# Altium schematic sheet 2.Support.SchDoc
size A3; SheetNumber: 3; SheetTotal: 10
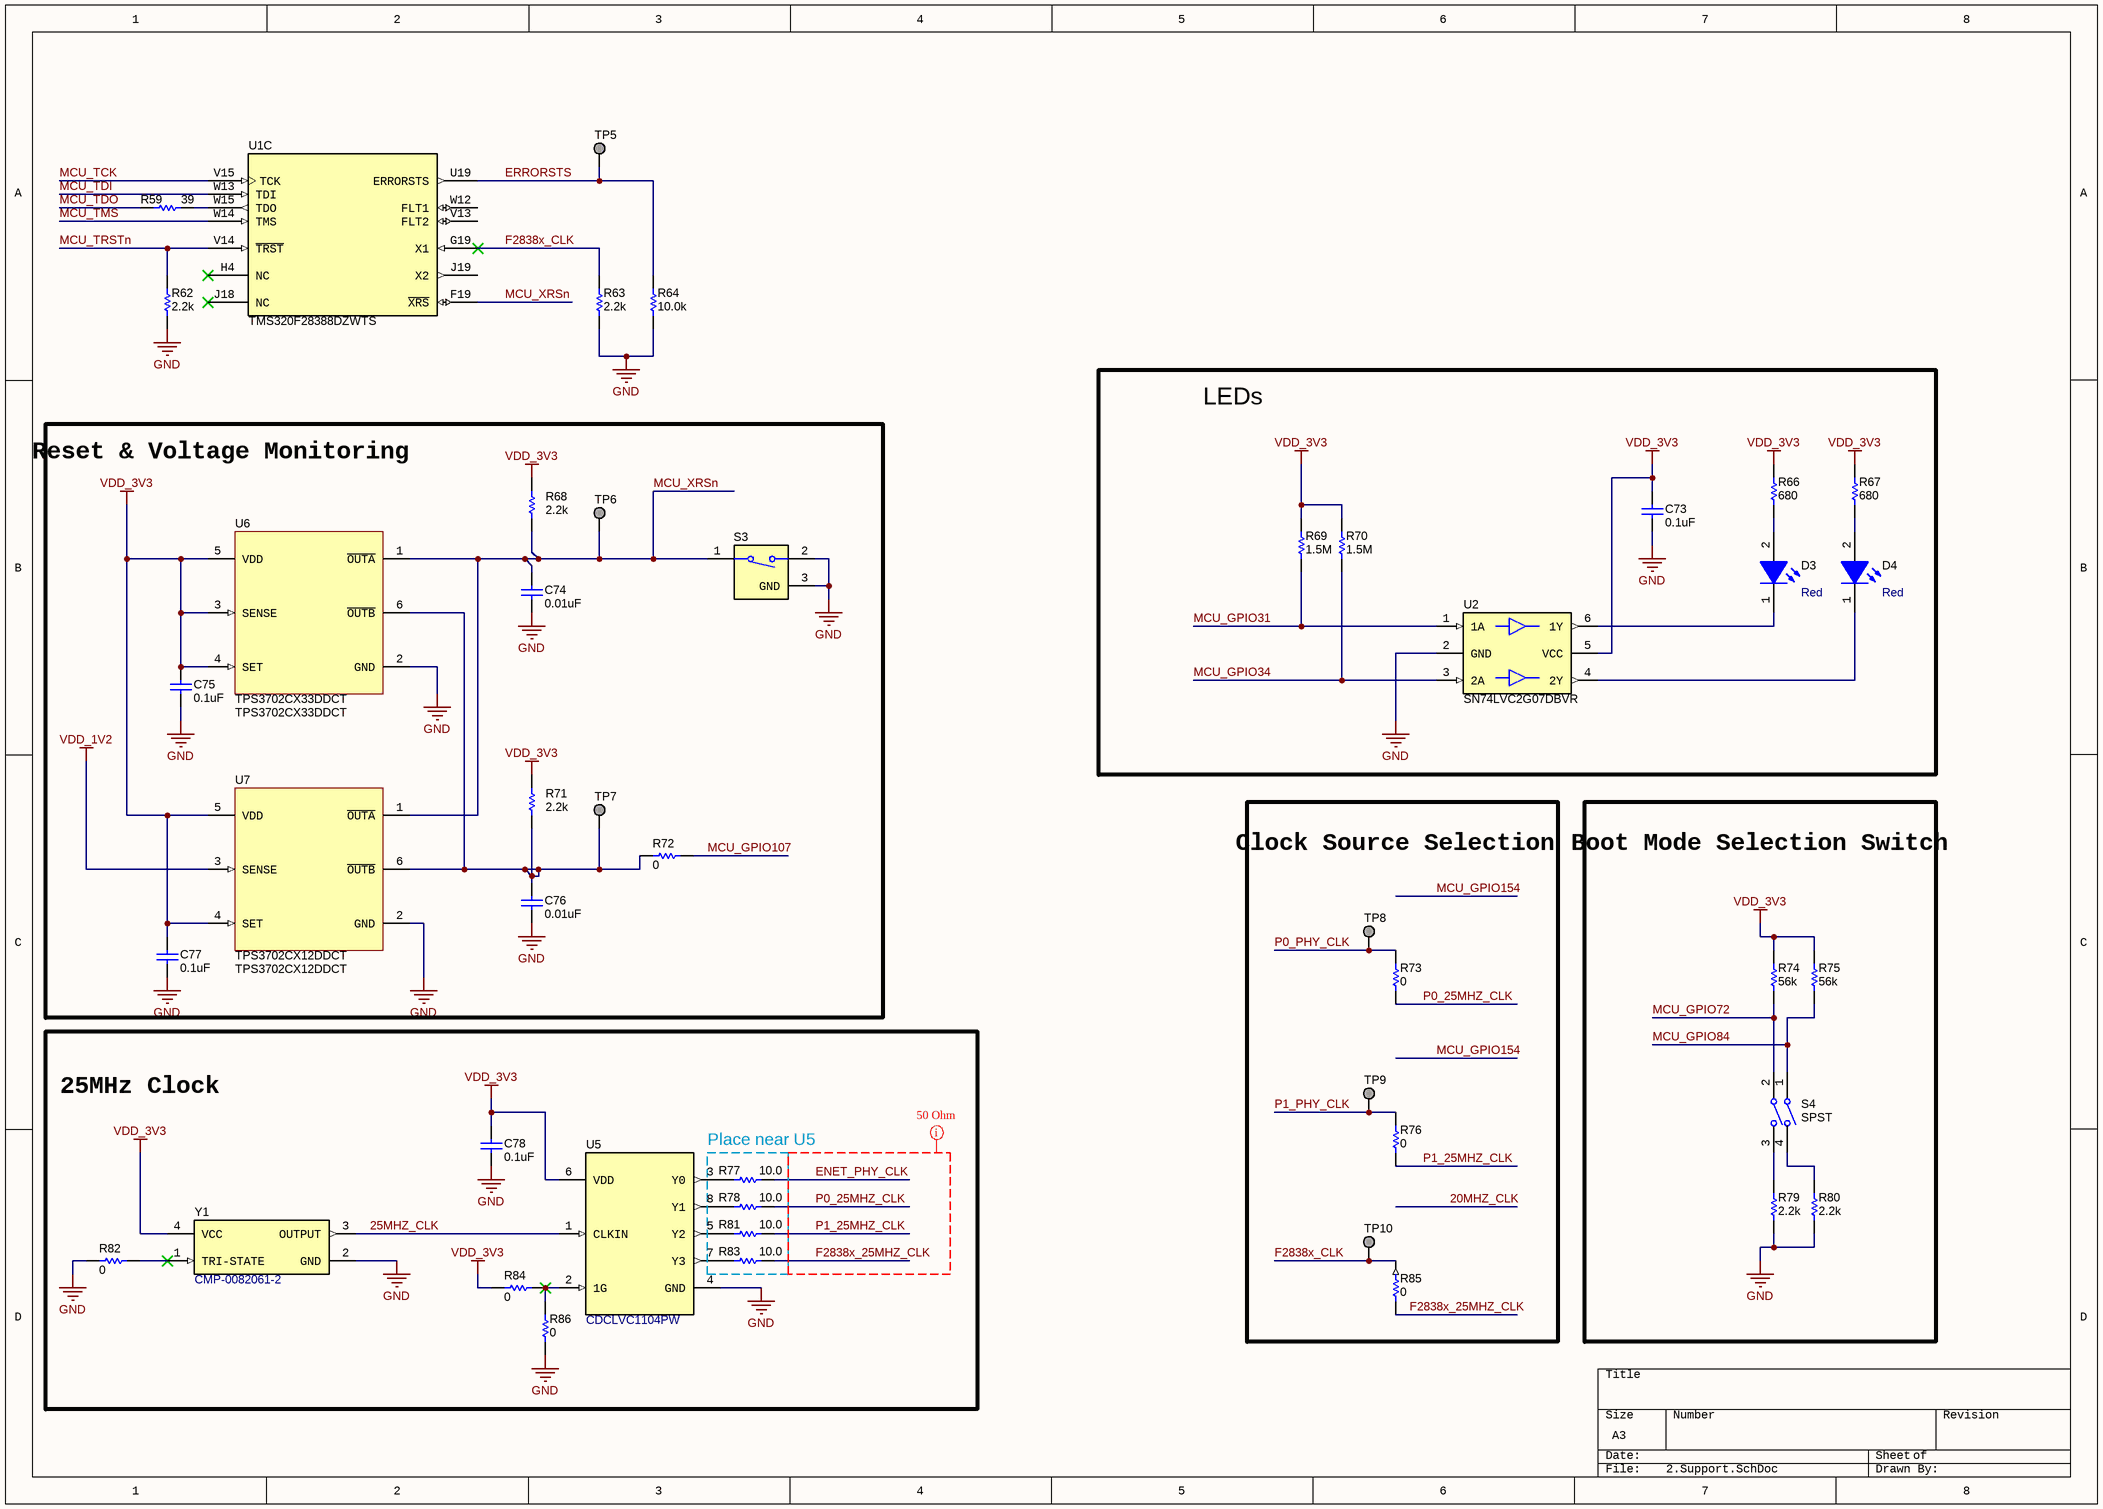
[diagram p0: 2.Support.SchDoc]

## Parts
C73  ValueDisplayed: 0.1uF  [0402]  (hidden comment: CL05B104KP5NNNC)
C74  ValueDisplayed: 0.01uF  [0402]  (hidden comment: C0402C103J5RACTU)
C75  ValueDisplayed: 0.1uF  [0402]  (hidden comment: CL05B104KP5NNNC)
C76  ValueDisplayed: 0.01uF  [0402]  (hidden comment: C0402C103J5RACTU)
C77  ValueDisplayed: 0.1uF  [0402]  (hidden comment: CL05B104KP5NNNC)
C78  ValueDisplayed: 0.1uF  [0402]  (hidden comment: CL05B104KP5NNNC)
D3  value Red  [WL-SMCW_RED_0805]  (hidden comment: 150080SS75000)
D4  value Red  [WL-SMCW_RED_0805]  (hidden comment: 150080SS75000)
R59  ValueDisplayed: 39  [0402]  (hidden comment: CRCW040239R0JNED)
R62  ValueDisplayed: 2.2k  [0402]  (hidden comment: CRCW04022K20JNED)
R63  ValueDisplayed: 2.2k  [0402]  (hidden comment: CRCW04022K20JNED)
R64  ValueDisplayed: 10.0k  [0402]  (hidden comment: RC0402FR-0710KL)
R66  ValueDisplayed: 680  [0402]  (hidden comment: CRCW0402680RJNED)
R67  ValueDisplayed: 680  [0402]  (hidden comment: CRCW0402680RJNED)
R68  ValueDisplayed: 2.2k  [0402]  (hidden comment: CRCW04022K20JNED)
R69  ValueDisplayed: 1.5M  [0402]  (hidden comment: CRCW04021M50JNED)
R70  ValueDisplayed: 1.5M  [0402]  (hidden comment: CRCW04021M50JNED)
R71  ValueDisplayed: 2.2k  [0402]  (hidden comment: CRCW04022K20JNED)
R72  ValueDisplayed: 0  [0603]  (hidden comment: CRCW06030000Z0EA)
R73  ValueDisplayed: 0  [0603]  (hidden comment: CRCW06030000Z0EA)
R74  ValueDisplayed: 56k  [0402]  (hidden comment: CRCW040256K0JNED)
R75  ValueDisplayed: 56k  [0402]  (hidden comment: CRCW040256K0JNED)
R76  ValueDisplayed: 0  [0603]  (hidden comment: CRCW06030000Z0EA)
R77  ValueDisplayed: 10.0  [CPF0402]  (hidden comment: CPF0402B10RE1)
R78  ValueDisplayed: 10.0  [CPF0402]  (hidden comment: CPF0402B10RE1)
R79  ValueDisplayed: 2.2k  [0402]  (hidden comment: CRCW04022K20JNED)
R80  ValueDisplayed: 2.2k  [0402]  (hidden comment: CRCW04022K20JNED)
R81  ValueDisplayed: 10.0  [CPF0402]  (hidden comment: CPF0402B10RE1)
R82  ValueDisplayed: 0  [0402]  (hidden comment: CRCW04020000Z0EDHP)
R83  ValueDisplayed: 10.0  [CPF0402]  (hidden comment: CPF0402B10RE1)
R84  ValueDisplayed: 0  [0402]  (hidden comment: CRCW04020000Z0EDHP)
R85  ValueDisplayed: 0  [0603]  (hidden comment: CRCW06030000Z0EA)
R86  ValueDisplayed: 0  [0402]  (hidden comment: CRCW04020000Z0EDHP)
S3  B3U-1100P  [SW_B3U-1100P]  (value not drawn)
S4  Circuit: SPST  [SW_218-2LP]  (hidden comment: 218-2LPST)
TP5  TESTPOINT  [TP_50MIL-25MILHOLE]  (value not drawn)  (no BOM)
TP6  TESTPOINT  [TP_50MIL-25MILHOLE]  (value not drawn)  (no BOM)
TP7  TESTPOINT  [TP_50MIL-25MILHOLE]  (value not drawn)  (no BOM)
TP8  TESTPOINT  [TP_50MIL-25MILHOLE]  (value not drawn)  (no BOM)
TP9  TESTPOINT  [TP_50MIL-25MILHOLE]  (value not drawn)  (no BOM)
TP10  TESTPOINT  [TP_50MIL-25MILHOLE]  (value not drawn)  (no BOM)
U1  TMS320F28388DZWTS  [ZWT0337A-IPC_B]  (part C of 5)
U2  SN74LVC2G07DBVR  [DBV0006A_N]
U5  CDCLVC1104PW  [PW0008A_N]
U6  TPS3702CX33DDCT  [DDC0006A_N]
U7  TPS3702CX12DDCT  [DDC0006A_N]
Y1  CMP-0082061-2  [ECS_ECS-2520S]

## Blocks framed on the sheet
LEDs: C73 D3 D4 R66 R67 R69 R70 U2
Reset & Voltage Monitoring: C74-C77 R68 R71 R72 S3 TP6 TP7 U6 U7
Clock Source Selection: R73 R76 R85 TP8-TP10
Boot Mode Selection Switch: R74 R75 R79 R80 S4
25MHz Clock: C78 R77 R78 R81-R84 R86 U5 Y1

## Nets
GND: C73.2 C74.2 C75.2 C76.2 C77.2 C78.2 R62.1 R63.1 R64.1 R79.2 R80.1 R82.2 R86.2 S3.2 S3.3(GND) U2.2(GND) U5.4(GND) U6.2(GND) U7.2(GND) Y1.2(GND)
VDD_1V2: U7.3(SENSE)
VDD_3V3: C73.1 C75.1 C77.1 C78.1 R66.1 R67.1 R68.2 R69.2 R70.2 R71.2 R74.1 R75.2 R84.1 U2.5(VCC) U5.6(VDD) U6.3(SENSE) U6.4(SET) U6.5(VDD) U7.4(SET) U7.5(VDD) Y1.4(VCC)
25MHZ_CLK: U5.1(CLKIN) Y1.3(OUTPUT)
ENET_PHY_CLK: R77.2
ERRORSTS: R64.2 TP5.1 U1.U19(ERRORSTS)
F2838x_25MHZ_CLK: R83.2 R85.2
F2838x_CLK: R63.2 R85.1 TP10.1 U1.G19(X1)
MCU_GPIO31: R69.1 U2.1(1A)
MCU_GPIO34: R70.1 U2.3(2A)
MCU_GPIO72: R74.2 S4.2
MCU_GPIO84: R75.1 S4.1
MCU_GPIO107: R72.2
MCU_TCK: U1.V15(TCK)
MCU_TDI: U1.W13(TDI)
MCU_TDO: R59.1
MCU_TMS: U1.W14(TMS)
MCU_TRSTn: R62.2 U1.V14(~{TRST})
MCU_XRSn: C74.1 R68.1 S3.1 TP6.1 U1.F19(~{XRS}) U6.1(~{OUTA}) U7.1(~{OUTA})
P0_25MHZ_CLK: R73.2 R78.2
P0_PHY_CLK: R73.1 TP8.1
P1_25MHZ_CLK: R76.2 R81.2
P1_PHY_CLK: R76.1 TP9.1
NetC76_1: C76.1 R71.1 R72.1 TP7.1 U6.6(~{OUTB}) U7.6(~{OUTB})
NetD3_1: D3.1(K) U2.6(1Y)
NetD3_2: D3.2(A) R66.2
NetD4_1: D4.1(K) U2.4(2Y)
NetD4_2: D4.2(A) R67.2
NetR59_2: R59.2 U1.W15(TDO)
NetR77_1: R77.1 U5.3(Y0)
NetR78_1: R78.1 U5.8(Y1)
NetR79_1: R79.1 S4.3
NetR80_2: R80.2 S4.4
NetR81_1: R81.1 U5.5(Y2)
NetR82_1: R82.1 Y1.1(TRI-STATE)
NetR83_1: R83.1 U5.7(Y3)
NetR84_2: R84.2 R86.1 U5.2(1G)

Not connected (* = marked no-connect by the designer): U1 H4(NC)* J18(NC)* J19(X2) V13(FLT2) W12(FLT1)

## Layout directives
50 Ohm Impedance: Undefined: ENET_PHY_CLK, F2838x_25MHZ_CLK, P0_25MHZ_CLK, P1_25MHZ_CLK

## Notes on the sheet
- Place near U5

## Library data of the parts
C73 C75 C77 C78 = CMP-0006343-2: CAP, CERM, 0.1 uF, 10 V, +/- 10%, X7R, 0402; Manufacturer: Samsung Electro-Mechanics; Polarized: N; Value: 0.1uF; U/M: EA; Cap_F: 100nF; Value1: Unknown; VDC_V: 10V; TaMin_C: -55°C; TaMax_C: 125°C; AEC Category: Q200; SizeArea_mm2: 0.5; SizeAreaWB_mm2: 3; SizeX_mm: 1; SizeZ_mm: 0.6; CompType: Capacitor; PartNumber: CL05B104KP5NNNC; PackageReference: 0402; RoHS: Y; Tolerance_%: 10%; Value2: 10V; MountType: SMT; Technology: Ceramic; TempCo: X7R; Cap_Case: 0402; Published: 2008-06-19; Publisher: Texas Instruments; LatestRevisionDate: 2017-03-09; ComponentLink1Description: Datasheet link; ComponentLink1URL: http://www.samsungsem.com/kr/front/downloadcms.do?path=/kr/support/product-search/mlcc/__icsFiles/afieldfile/2014/11/05&fileName=S_CL05B104KP5NNNC.pdf; AEC Qualified: N; AEC Grade: N/A; SizeY_mm: 0.5
C74 C76 = CMP-0006236-2: CAP, CERM, 0.01 uF, 50 V, +/- 5%, X7R, 0402; Manufacturer: Kemet; TaMin_C: -55°C; Polarized: N; SizeAreaWB_mm2: 3; Value1: Unknown; U/M: EA; Value: 0.01uF; TaMax_C: 125°C; SizeZ_mm: 0.6; SizeX_mm: 1; SizeY_mm: 0.5; Value2: 50V; Cap_F: 10nF; AEC Category: Q200; Supplier Part Number 2: 57J0044; Publisher: Texas Instruments; Supplier 2: Newark; Supplier Part Number 3: 80-C0402C103J5R; TempCo: X7R; Supplier 3: Mouser; Published: 2008-06-19; RoHS: Y; MountType: SMT; Supplier 1: Digi-Key; PackageReference: 0402; Tolerance_%: 5%; Cap_Case: 0402; SizeArea_mm2: 0.5; CompType: Capacitor; LatestRevisionDate: 2017-03-09; PartNumber: C0402C103J5RACTU; AEC Qualified: ?; ComponentLink1Description: Datasheet link; Supplier Part Number 1: 399-7758-1-ND; Technology: Ceramic; ComponentLink1URL: http://www.kemet.com/Lists/ProductCatalog/Attachments/53/KEM_C1002_X7R_SMD.pdf
D3 = CMP-0002951-3: LED, Red, SMD; Manufacturer: Wurth Elektronik; Type: AlInGaP; Angle: 140; Vr_V: 5V; Ir_A: 25µA; Vf_V: 1.9V; Value1: 0.072W; Tjmax_C: 85°C; Io_A: 30mA; Power_TotalModule: 72mW; CompType: LED; PartNumber: 150080SS75000; Color: Red; MountType: SMT; ComponentLink1URL: http://katalog.we-online.de/led/datasheet/150080SS75000.pdf; PackageReference: LED_0805; ComponentLink1Description: Datasheet link; Value2: 1.9V; RoHS: Y
D4 = CMP-0002951-3: LED, Red, SMD; Manufacturer: Wurth Elektronik; Type: AlInGaP; Vf_V: 1.9V; Io_A: 30mA; Vr_V: 5V; Ir_A: 25µA; Tjmax_C: 85°C; Power_TotalModule: 72mW; Value1: 0.072W; Angle: 140; PartNumber: 150080SS75000; PackageReference: LED_0805; RoHS: Y; CompType: LED; MountType: SMT; Value2: 1.9V; Color: Red; ComponentLink1URL: http://katalog.we-online.de/led/datasheet/150080SS75000.pdf; ComponentLink1Description: Datasheet link
R59 = CMP-0026916-3: RES, 39, 5%, 0.063 W, AEC-Q200 Grade 0, 0402; Manufacturer: Vishay-Dale; Power_W: 63mW; TempCo: 200 ppm/C; Value_Code: 39R0; Value: 39; EIA_Code: E24; SizeX_mm: 1; SizeY_mm: 0.5; SizeZ_mm: 0.6; Value2: 0.063W; AEC Qualified: Y; VDC_V: 50V; AEC Category: Q200; AEC Grade: 0; Supplier Part Number 2: 89M6649; Supplier 2: Newark; Supplier Part Number 3: 71-CRCW0402J-39-E3; Supplier 3: Mouser; RoHS: E; Value1: 5%; MountType: SMT; Supplier 1: Digi-Key; PackageReference: 0402; Tolerance_%: 5%; Res_ohm: 39; SizeArea_mm2: 0.5; CompType: Resistor; PartNumber: CRCW040239R0JNED; ComponentLink1Description: Datasheet link; Supplier Part Number 1: 541-39JCT-ND; Technology: Thick Film; ComponentLink1URL: http://www.vishay.com/docs/20035/dcrcwe3.pdf
R62 R63 = CMP-0026890-5: RES, 2.2 k, 5%, 0.063 W, AEC-Q200 Grade 0, 0402; Manufacturer: Vishay-Dale; Power_W: 63mW; TempCo: 200 ppm/C; Value_Code: 2k20; Value: 2.2k; EIA_Code: E24; SizeX_mm: 1; SizeY_mm: 0.5; SizeZ_mm: 0.6; Value2: 0.063W; AEC Qualified: Y; VDC_V: 50V; AEC Category: Q200; AEC Grade: 0; Supplier Part Number 2: 59M6710; Supplier 2: Newark; Supplier Part Number 3: 71-CRCW0402J-2.2K-E3; Supplier 3: Mouser; RoHS: E; Value1: 5%; MountType: SMT; Supplier 1: Digi-Key; PackageReference: 0402; Tolerance_%: 5%; Res_ohm: 2.2k; SizeArea_mm2: 0.5; CompType: Resistor; PartNumber: CRCW04022K20JNED; ComponentLink1Description: Datasheet link; Supplier Part Number 1: 541-2.2KJCT-ND; Technology: Thick Film; ComponentLink1URL: http://www.vishay.com/docs/20035/dcrcwe3.pdf
R64 = CMP-0078669-1: RES, 10.0 k, 1%, 0.063 W, 0402; Manufacturer: Yageo America; Power_W: 63mW; Green_Lifecycle: Active; TempCo: 100 ppm/C; Value_Code: 10k0; Green_REACh: Passed; Value: 10.0k; EIA_Code: E96; Res_ohm: 10k; SizeX_mm: 1; SizeY_mm: 0.5; SizeZ_mm: 0.6; Value2: 0.063W; AEC Qualified: N; AEC Category: Q200; ComponentLink1URL: http://www.yageo.com/documents/recent/PYu-RC_Group_51_RoHS_L_8.pdf; Supplier Part Number 2: 98K7499; Supplier 2: Newark; Supplier Part Number 3: 603-RC0402FR-0710KL; Supplier 3: Mouser; RoHS: Y; Value1: 1%; MountType: SMT; Green_EU RoHS-2: Passed; Supplier 1: Digi-Key; Green_EU RoHS: Passed with Exemption; PackageReference: 0402; Tolerance_%: 1%; SizeArea_mm2: 0.5; CompType: Resistor; PartNumber: RC0402FR-0710KL; ComponentLink1Description: Datasheet link; AEC Grade: N/A; Supplier Part Number 1: 311-10.0KLRCT-ND; Technology: Thick Film
R66 R67 = CMP-0026962-3: RES, 680, 5%, 0.063 W, AEC-Q200 Grade 0, 0402; Manufacturer: Vishay-Dale; Value: 680; Value_Code: 680R; Power_W: 63mW; Value2: 0.063W; VDC_V: 50V; TempCo: 200 ppm/C; EIA_Code: E24; AEC Category: Q200; AEC Qualified: Y; AEC Grade: 0; SizeArea_mm2: 0.5; SizeX_mm: 1; SizeZ_mm: 0.6; CompType: Resistor; PartNumber: CRCW0402680RJNED; PackageReference: 0402; RoHS: E; Res_ohm: 680; Tolerance_%: 5%; Value1: 5%; MountType: SMT; Technology: Thick Film; ComponentLink1Description: Datasheet link; ComponentLink1URL: http://www.vishay.com/docs/20035/dcrcwe3.pdf; Supplier 1: Digi-Key; Supplier Part Number 1: 541-680JCT-ND; Supplier 2: Newark; Supplier Part Number 2: 59M6744; Supplier 3: Mouser; Supplier Part Number 3: 71-CRCW0402J-680-E3; SizeY_mm: 0.5
R68 R71 R79 R80 = CMP-0026890-5: RES, 2.2 k, 5%, 0.063 W, AEC-Q200 Grade 0, 0402; Manufacturer: Vishay-Dale; Value: 2.2k; Value_Code: 2k20; Power_W: 63mW; Value2: 0.063W; VDC_V: 50V; TempCo: 200 ppm/C; EIA_Code: E24; AEC Category: Q200; AEC Qualified: Y; AEC Grade: 0; SizeArea_mm2: 0.5; SizeX_mm: 1; SizeZ_mm: 0.6; CompType: Resistor; PartNumber: CRCW04022K20JNED; PackageReference: 0402; RoHS: E; Res_ohm: 2.2k; Tolerance_%: 5%; Value1: 5%; MountType: SMT; Technology: Thick Film; ComponentLink1Description: Datasheet link; ComponentLink1URL: http://www.vishay.com/docs/20035/dcrcwe3.pdf; Supplier 1: Digi-Key; Supplier Part Number 1: 541-2.2KJCT-ND; Supplier 2: Newark; Supplier Part Number 2: 59M6710; Supplier 3: Mouser; Supplier Part Number 3: 71-CRCW0402J-2.2K-E3; SizeY_mm: 0.5
R69 R70 = CMP-0026863-2: RES, 1.5 M, 5%, 0.063 W, AEC-Q200 Grade 0, 0402; Manufacturer: Vishay-Dale; Power_W: 63mW; TempCo: 200 ppm/C; Value_Code: 1M50; Value: 1.5Meg; EIA_Code: E24; SizeX_mm: 1; SizeY_mm: 0.5; SizeZ_mm: 0.6; Value2: 0.063W; AEC Qualified: Y; VDC_V: 50V; AEC Category: Q200; AEC Grade: 0; ComponentLink1URL: http://www.vishay.com/docs/20035/dcrcwe3.pdf; Supplier Part Number 2: 71-CRCW04021M50JNED; Supplier 2: Mouser; RoHS: E; Value1: 5%; MountType: SMT; Supplier 1: Digi-Key; PackageReference: 0402; Tolerance_%: 5%; Res_ohm: 1.5M; SizeArea_mm2: 0.5; CompType: Resistor; PartNumber: CRCW04021M50JNED; ComponentLink1Description: Datasheet link; Supplier Part Number 1: 541-1.5MJCT-ND; Technology: Thick Film
R72 R73 R76 R85 = CMP-0025697-4: RES, 0, 5%, 0.1 W, AEC-Q200 Grade 0, 0603; Manufacturer: Vishay-Dale; Value: 0; Value_Code: 0000; Power_W: 100mW; Value2: 0.1W; VDC_V: 75V; TempCo: 200 ppm/C; EIA_Code: E24; AEC Category: Q200; AEC Qualified: Y; SizeArea_mm2: 1.28; SizeX_mm: 1.6; SizeY_mm: 0.8; SizeZ_mm: 1; CompType: Resistor; PartNumber: CRCW06030000Z0EA; PackageReference: 0603; RoHS: E; Res_ohm: 0; Tolerance_%: 5%; Value1: 5%; MountType: SMT; Technology: Thick Film; ComponentLink1Description: Datasheet link; ComponentLink1URL: http://www.vishay.com/docs/20035/dcrcwe3.pdf; Supplier 1: Digi-Key; Supplier Part Number 1: 541-0.0GCT-ND; Supplier 2: Newark; Supplier Part Number 2: 52K8014; Supplier 3: Mouser; Supplier Part Number 3: 71-CRCW0603-0-E3; AEC Grade: 0
R74 R75 = CMP-0026949-3: RES, 56 k, 5%, 0.063 W, AEC-Q200 Grade 0, 0402; Manufacturer: Vishay-Dale; Value: 56k; Value_Code: 56k0; Power_W: 63mW; Value2: 0.063W; VDC_V: 50V; TempCo: 200 ppm/C; EIA_Code: E24; AEC Category: Q200; AEC Qualified: Y; AEC Grade: 0; SizeArea_mm2: 0.5; SizeX_mm: 1; SizeZ_mm: 0.6; CompType: Resistor; PartNumber: CRCW040256K0JNED; PackageReference: 0402; RoHS: E; Res_ohm: 56k; Tolerance_%: 5%; Value1: 5%; MountType: SMT; Technology: Thick Film; ComponentLink1Description: Datasheet link; ComponentLink1URL: http://www.vishay.com/docs/20035/dcrcwe3.pdf; Supplier 1: Digi-Key; Supplier Part Number 1: 541-56KJCT-ND; Supplier 2: Newark; Supplier Part Number 2: 89M6680; Supplier 3: Mouser; Supplier Part Number 3: 71-CRCW0402J-56K-E3; SizeY_mm: 0.5
R77 R78 R81 R83 = CMP-0026765-1: RES, 10.0, 0.1%, 0.063 W, 0402; Manufacturer: TE Connectivity; Power_W: 63mW; TempCo: 25 ppm/C; Value_Code: 10R0; U/M: EA; Value: 10.0; EIA_Code: E192; Res_ohm: 10; SizeX_mm: 1; SizeY_mm: 0.5; SizeZ_mm: 0.35; Value2: 0.063W; AEC Qualified: N; AEC Category: Q200; ComponentLink1URL: http://www.te.com/commerce/DocumentDelivery/DDEController?Action=srchrtrv&DocNm=1773200&DocType=DS&DocLang=English; Supplier Part Number 2: 80P3855; Publisher: Texas Instruments; Supplier 2: Newark; Supplier Part Number 3: 279-CPF0402B10RE1; Supplier 3: Mouser; Published: 2008-06-26; RoHS: Y; Value1: 0.1%; MountType: SMT; Supplier 1: Digi-Key; PackageReference: 0402; Tolerance_%: 0.1%; SizeArea_mm2: 0.5; CompType: Resistor; LatestRevisionDate: 2017-03-09; PartNumber: CPF0402B10RE1; ComponentLink1Description: Datasheet link; AEC Grade: N/A; Supplier Part Number 1: A102583CT-ND; Technology: Thin Film
R82 R84 R86 = CMP-0081856-1: RES, 0, 0%, 0.2 W, AEC-Q200 Grade 0, 0402; Manufacturer: Vishay-Dale; SizeAreaWB_mm2: 3; SizeArea_mm2: 0.5; AEC Qualified: Y; AEC Category: Q200; Value: 0; SizeZ_mm: 0.6; Power_W: 200mW; VDC_V: 50V; Value2: 0.2W; SizeX_mm: 1; ComponentLink1Description: Datasheet link; RoHS: Y; Supplier Part Number 3: 71-CRCW04020000Z0EDH; Tolerance_%: 0%; Value_Code: 0; Supplier 1: Digi-Key; PackageReference: 0402; Technology: Thick Film; Res_ohm: 0; PartNumber: CRCW04020000Z0EDHP; Supplier Part Number 2: 96Y9050; Supplier 2: Newark; AEC Grade: 0; SizeY_mm: 0.5; ComponentLink1URL: http://www.vishay.com/docs/20043/crcwhpe3.pdf; Value1: 0%; CompType: Resistor; MountType: SMT; Supplier Part Number 1: 541-0.0YBTR-ND; Supplier 3: Mouser
S3 = CMP-0002193-2: Switch, SPST-NO, Off-Mom, 12 V, SMD; Manufacturer: Omron Electronic Components; CurrentRating_mA: 50A; PositionCount: 1; VDC_V: 12V; Supplier 2: Newark; Supplier 3: Mouser; Supplier 1: Digi-Key; Supplier Part Number 1: SW1021CT-ND; Supplier Part Number 2: 39M4619; Supplier Part Number 3: 653-B3U-1100P; PartNumber: B3U-1100P; ComponentLink1Description: Datasheet URL; LatestRevisionDate: 2017-03-09; CompType: Switch; Publisher: Texas Instruments; Circuit: SPST-NO; RoHS: Y; Orientation: Top Actuated; SwitchFunction: Off-Mom; PackageReference: SMD, 3-Leads, Body 3x2.5mm; MountType: SMT; ComponentLink1URL: http://www.omron.com/ecb/products/pdf/en-b3u.pdf
S4 = CMP-0002230-1: Switch, SPST, 2 Pos, 25mA, 24VDC, SMD; Manufacturer: CTS Electrocomponents; VDC_V: 24V; SwitchFunction: Off-On; PositionCount: 2; CurrentRating_mA: 25A; PartNumber: 218-2LPST; MountType: SMT; ComponentLink1Description: Datasheet Link; ComponentLink1URL: http://www.ctscorp.com/components/Datasheets/218.pdf; RoHS: Y; Orientation: Top Actuated; CompType: Switch; PackageReference: 3.71x5.8mm; Publisher: Texas Instruments; LatestRevisionDate: 2017-03-09; Supplier 1: Digi-Key; Supplier Part Number 1: CT2182LPST-ND; Supplier 2: Mouser; Supplier Part Number 2: 774-2182LPST
TP5-TP10 = CMP-0078143-3: TEST POINT.  No entry in BOM.; CompType: Testpoint; PackageReference: N/A; Manufacturer: N/A; PartNumber: N/A; Library Reference: TESTPOINT
U1 = CMP-012-000147-1: TMS320F28388DZWTS, ZWT0337A (NFBGA-337); Alternate Manufacturer: Texas Instruments; SizeY_mm: 16; SizeArea_mm2: 256; AEC Qualified: N; SizeAreaWB_mm2: 324; SizeZ_mm: 1.4; Available Preview Images: 2D; CompType: IC; AEC Category: Q200; ComponentLink2URL: http://www.ti.com/product/tms320f28388d; MountType: SMT; ComponentLink3Description: Online Datasheet; PackageDescription: NFBGA-337; ComponentLink3URL: http://www.ti.com/product/tms320f28388d/datasheet; SizeX_mm: 16; Design Item ID: TMS320F28388DZWTS; ComponentLink1URL: http://www.ti.com/lit/ds/symlink/tms320f28388d.pdf; Source: SamacSys.SchLib; ComponentLink2Description: Product Folder; PackageReference: ZWT0337A; Manufacturer: Texas Instruments; ComponentLink1Description: Datasheet Link
U2 = CMP-0051789-2: Dual Buffer/Driver with Open-Drain Output, DBV0006A, LARGE T&R; Manufacturer: Texas Instruments; 3-State Output: No; Bits(#): 2; F @ Nom Voltage(Max)(Mhz): 150; ICC @ Nom Voltage(Max)(mA): 0.01; Input Type: CMOS/TTL; Logic: True; Output Drive (IOL/IOH)(Max)(mA): 32/-32; Output Type: CMOS; Rating: Catalog; Sub-Family: Inverting Buffer/Driver; Technology Family: LVC; tpd @ Nom Voltage(Max)(ns): 8.6,4.4,3.7,2.9; VCC(Max)(V): 5.5; VCC(Min)(V): 1.65; Voltage(Nom)(V): 1.8,2.5,3.3,5; AEC Category: Q200; AEC Qualified: N; CompType: IC; Green_Lifecycle: Active; Green_REACh: Passed; SizeArea_mm2: 8.12; SizeAreaWB_mm2: 14.82; SizeX_mm: 2.8; SizeY_mm: 2.9; SizeZ_mm: 1.45; PackageReference: DBV0006A; DatasheetVersion: SCES308K; Generic Part Number: SN74LVC2G07; Operating Temperature Range(C): -40 to 125; Schmitt Trigger: No; ComponentLink1Description: Datasheet Link; ComponentLink1URL: http://www.ti.com/lit/ds/symlink/sn74lvc2g07.pdf; ComponentLink2Description: Product Folder; ComponentLink2URL: http://www.ti.com/product/sn74lvc2g07; ComponentLink3Description: Online Datasheet; ComponentLink3URL: http://www.ti.com/product/sn74lvc2g07/datasheet; Green_EU RoHS-2: Passed; Green_EU RoHS: Passed; MountType: SMT; PackageDescription: SOT-23-6; PartNumber: SN74LVC2G07DBVR; RoHS: Y
U5 = CMP-052-000006-1: Low Jitter, 1:4 LVCMOS Fan-out Clock Buffer, PW0008A (TSSOP-8); Manufacturer: Texas Instruments; Green_REACh: Passed; SizeArea_mm2: 19.2; SizeY_mm: 3.0; SizeX_mm: 6.4; Available Preview Images: 2D; SizeZ_mm: 1.2; Green_Lifecycle: Active; SizeAreaWB_mm2: 42.0; U/M: EA; CompType: IC; PackageReference: PW0008A; ComponentLink1Description: Datasheet Link; Publisher: Texas Instruments; PartNumber: CDCLVC1104PW; PackageDescription: TSSOP-8; RoHS: Y; Design Item ID: CDCLVC1104PW; Source: MCU063B.SCHLIB; Green_EU RoHS: Passed; MountType: SMT; Alternate Manufacturer: Texas Instruments; ComponentLink1URL: http://www.ti.com/lit/ds/symlink/cdclvc1104.pdf; Green_EU RoHS-2: Passed; LatestRevisionDate: 2017-06-09
U6 U7 = CMP-052-000005-1: High-Accuracy, Fixed-Threshold OV/UV Monitor, DDC0006A (SOT-23-T-6); Alternate PartNumber: TPS3702CX33DDCR; Alternate Manufacturer: Texas Instruments; SizeX_mm: 1.65; SizeY_mm: 2.95; SizeArea_mm2: 4.8675; SizeZ_mm: 0.87; SizeAreaWB_mm2: 10.4675; AEC Qualified: N; CompType: IC; Available Preview Images: 2D; AEC Category: Q200; Source: MCU063B.SCHLIB; ComponentLink2URL: http://www.ti.com/product/tps3702; RoHS: Y; ComponentLink3Description: Online Datasheet; ComponentLink3URL: http://www.ti.com/product/tps3702/datasheet; PackageDescription: SOT-23-T-6; MountType: SMT; ComponentLink1Description: Datasheet Link; Design Item ID: TPS3702CX33DDCT; PackageReference: DDC0006A; ComponentLink1URL: http://www.ti.com/lit/ds/symlink/tps3702.pdf; ComponentLink2Description: Product Folder; Manufacturer: Texas Instruments
  U6: PartNumber: TPS3702CX33DDCT
  U7: PartNumber: TPS3702CX12DDCT
Y1 = CMP-052-000000-1: Oscillator, 25 MHz, 15 pF, SMD; Manufacturer: ECS Inc.; PartNumber: ECS-2520S33-250-FN-TR; SizeZ_mm: 1; SizeY_mm: 2.5; SizeX_mm: 2; Load Capacitance: 15pF; AEC Qualified: N; Available Preview Images: 2D; Frequency Stability: 10 ppm; TaMin_C: -40°C; Frequency_Fixed: 25MHz; SizeAreaWB_mm2: 10.5; TaMax_C: 85°C; AEC Category: Q200; SizeArea_mm2: 5; Design Item ID: CMP-0082061-2; CompType: Oscillator; Source: MCU063B.SCHLIB; RoHS: Y; ComponentLink1Description: Datasheet Link; PackageReference: 2x2.5mm; ComponentLink1URL: https://www.ecsxtal.com/store/pdf/ECS-2520S.pdf; AEC Grade: N/A; MountType: SMT